# Altium schematic sheet ART-Pi_Power.SchDoc: POWER_Distribution
size A3; DocumentNumber: 5; Revision: V1.5; SheetNumber: 5; SheetTotal: 11; PageSetup: Record=PageOptions|CenterHorizontal=True|CenterVertical=True|PrintScale=1.01|XCorrection=1.00|YCorrection=1.00|PrintKind=0|BorderSize=5000000|LeftOffset=0|BottomOffset=0|Orientation=2|PaperLength=1000|PaperWidth=1000|Scale=100|PaperSource=7|PrintQuality=600|MediaType=1|DitherType=10|PrintScaleMode=1|PaperKind=A3(297x420mm)|PaperIndex=8
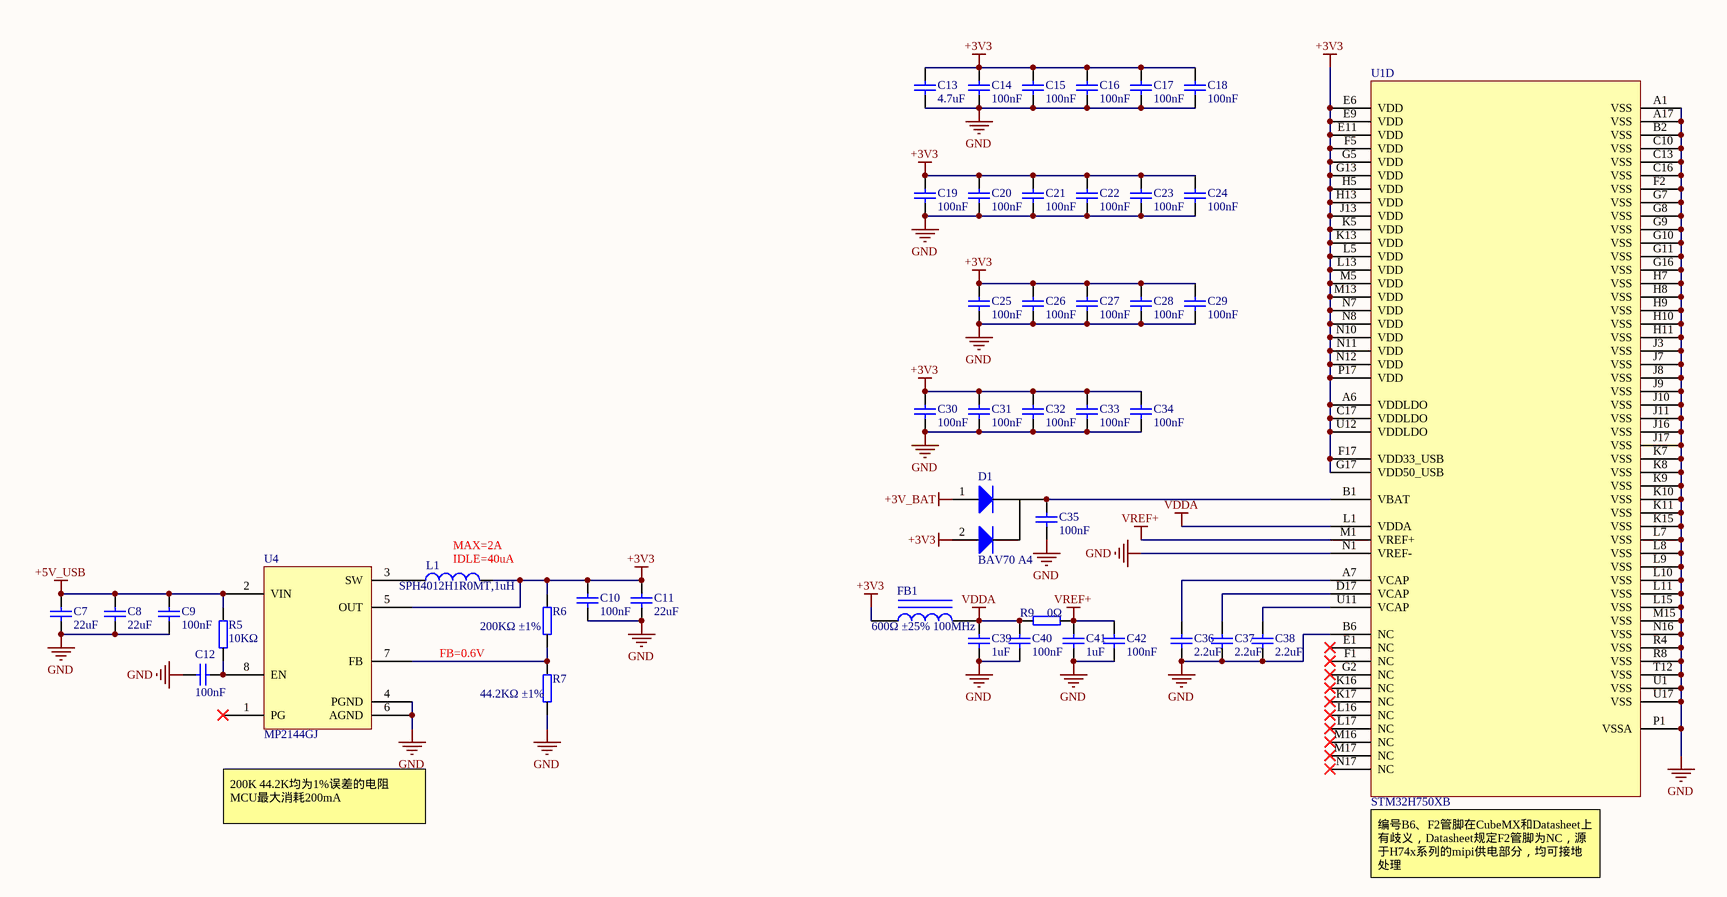
[diagram p0: ART-Pi_Power.SchDoc]

## Parts
C7  22uF  [0603_C]
C8  22uF  [0603_C]
C9  100nF  [0402_C]
C10  100nF  [0402_C]
C11  22uF  [0603_C]
C12  100nF  [0402_C]
C13  4.7uF  [0402_C]
C14  100nF  [0402_C]
C15  100nF  [0402_C]
C16  100nF  [0402_C]
C17  100nF  [0402_C]
C18  100nF  [0402_C]
C19  100nF  [0402_C]
C20  100nF  [0402_C]
C21  100nF  [0402_C]
C22  100nF  [0402_C]
C23  100nF  [0402_C]
C24  100nF  [0402_C]
C25  100nF  [0402_C]
C26  100nF  [0402_C]
C27  100nF  [0402_C]
C28  100nF  [0402_C]
C29  100nF  [0402_C]
C30  100nF  [0402_C]
C31  100nF  [0402_C]
C32  100nF  [0402_C]
C33  100nF  [0402_C]
C34  100nF  [0402_C]
C35  100nF  [0402_C]
C36  2.2uF  [0402_C]
C37  2.2uF  [0402_C]
C38  2.2uF  [0402_C]
C39  1uF  [0402_C]
C40  100nF  [0402_C]
C41  1uF  [0402_C]
C42  100nF  [0402_C]
D1  BAV70 A4  [SOT23_P]
FB1  value 600Ω ±25% 100MHz  [0402_R]  (hidden comment: Inductor Iron)
L1  SPH4012H1R0MT,1uH  [SPH4012H1R0MT]
R5  10KΩ  [0402_R]
R6  200KΩ ±1%  [0402_R]
R7  44.2KΩ ±1%  [0402_R]
R9  0Ω  [0402_R]
U1  STM32H750XB  [TFBGA240+25]  (part D of 4)
U4  MP2144GJ  [TSOP23-8]

## Nets
+3V3: C10.2 C11.2 C13.2 C14.2 C15.2 C16.2 C17.2 C18.2 C19.2 C20.2 C21.2 C22.2 C23.2 C24.2 C25.2 C26.2 C27.2 C28.2 C29.2 C30.2 C31.2 C32.2 C33.2 C34.2 D1.2 FB1.1 L1.2 R6.2 U1.A6(VDDLDO) U1.C17(VDDLDO) U1.E6(VDD) U1.E9(VDD) U1.E11(VDD) U1.F5(VDD) U1.F17(VDD33_USB) U1.G5(VDD) U1.G13(VDD) U1.G17(VDD50_USB) U1.H5(VDD) U1.H13(VDD) U1.J13(VDD) U1.K5(VDD) U1.K13(VDD) U1.L5(VDD) U1.L13(VDD) U1.M5(VDD) U1.M13(VDD) U1.N7(VDD) U1.N8(VDD) U1.N10(VDD) U1.N11(VDD) U1.N12(VDD) U1.P17(VDD) U1.U12(VDDLDO) U4.5(OUT)
+3V_BAT: D1.1
+5V_USB: C7.2 C8.2 C9.2 R5.2 U4.2(VIN)
GND: C7.1 C8.1 C9.1 C10.1 C11.1 C12.2 C13.1 C14.1 C15.1 C16.1 C17.1 C18.1 C19.1 C20.1 C21.1 C22.1 C23.1 C24.1 C25.1 C26.1 C27.1 C28.1 C29.1 C30.1 C31.1 C32.1 C33.1 C34.1 C35.1 C36.1 C37.1 C38.1 C39.1 C40.1 C41.1 C42.1 R7.1 U1.A1(VSS) U1.A17(VSS) U1.B2(VSS) U1.B6(NC) U1.C10(VSS) U1.C13(VSS) U1.C16(VSS) U1.F2(VSS) U1.G7(VSS) U1.G8(VSS) U1.G9(VSS) U1.G10(VSS) U1.G11(VSS) U1.G16(VSS) U1.H7(VSS) U1.H8(VSS) U1.H9(VSS) U1.H10(VSS) U1.H11(VSS) U1.J3(VSS) U1.J7(VSS) U1.J8(VSS) U1.J9(VSS) U1.J10(VSS) U1.J11(VSS) U1.J16(VSS) U1.J17(VSS) U1.K7(VSS) U1.K8(VSS) U1.K9(VSS) U1.K10(VSS) U1.K11(VSS) U1.K15(VSS) U1.L7(VSS) U1.L8(VSS) U1.L9(VSS) U1.L10(VSS) U1.L11(VSS) U1.L15(VSS) U1.M15(VSS) U1.N1(VREF-) U1.N16(VSS) U1.P1(VSSA) U1.R4(VSS) U1.R8(VSS) U1.T12(VSS) U1.U1(VSS) U1.U17(VSS) U4.4(PGND) U4.6(AGND)
VDDA: C39.2 C40.2 FB1.2 R9.2 U1.L1(VDDA)
VREF+: C41.2 C42.2 R9.1 U1.M1(VREF+)
NetC12_1: C12.1 R5.1 U4.8(EN)
NetC35_2: C35.2 D1.3 U1.B1(VBAT)
NetC36_2: C36.2 U1.A7(VCAP)
NetC37_2: C37.2 U1.D17(VCAP)
NetC38_2: C38.2 U1.U11(VCAP)
NetL1_1: L1.1 U4.3(SW)
NetR6_1: R6.1 R7.2 U4.7(FB)

Not connected (* = marked no-connect by the designer): U1 E1(NC)* F1(NC)* G2(NC)* K16(NC)* K17(NC)* L16(NC)* L17(NC)* M16(NC)* M17(NC)* N17(NC)*; U4 1(PG)*

## Notes on the sheet
- (near L1) MAX=2A
- (near L1) IDLE=40uA
- FB=0.6V
- 200K 44.2K均为1%误差的电阻
  MCU最大消耗200mA
- (near U1) 编号B6、F2管脚在CubeMX和Datasheet上有歧义，Datasheet规定F2管脚为NC，源于H74x系列的mipi供电部分，均可接地处理
- Title
- Size:
- Date:
- A3
- Number:
- Time:
- Revision:
- Sheet
- of
- File:

## Library data of the parts
C7-C42 = Cap: Capacitor; Published: 8-Jun-2000; LatestRevisionDate: 17-Jul-2002; LatestRevisionNote: Re-released for DXP Platform.; PackageReference: RAD-0.3; Publisher: Altium Limited; PackageDescription: Radial Cap, Thru-Hole; 2 Leads; 0.3 in Pin Spacing
FB1 = Inductor Iron: Magnetic-Core Inductor; Published: 24-Mar-1999; LatestRevisionDate: 17-Jul-2002; LatestRevisionNote: Re-released for DXP Platform.; PackageReference: AXIAL-0.9; Publisher: Altium Limited; PackageDescription: Axial Device, Thru-Hole; 2 Leads; 0.9 in Pin Spacing
L1 = Inductor: Code_IEC: 1005; Value: 10mH; Published: 8-Jun-2000; LatestRevisionDate: 29-May-2009; LatestRevisionNote: IPC-7351 Footprint Added.; PackageReference: 0402-A; Publisher: Altium Limited; PackageDescription: Chip Inductor; Code_JEITA: 0402
R5-R7 R9 = Res: Resister